# EAGLE design DAMPOWER (EAGLE 7.4.0)

## Sheet 1 of 3
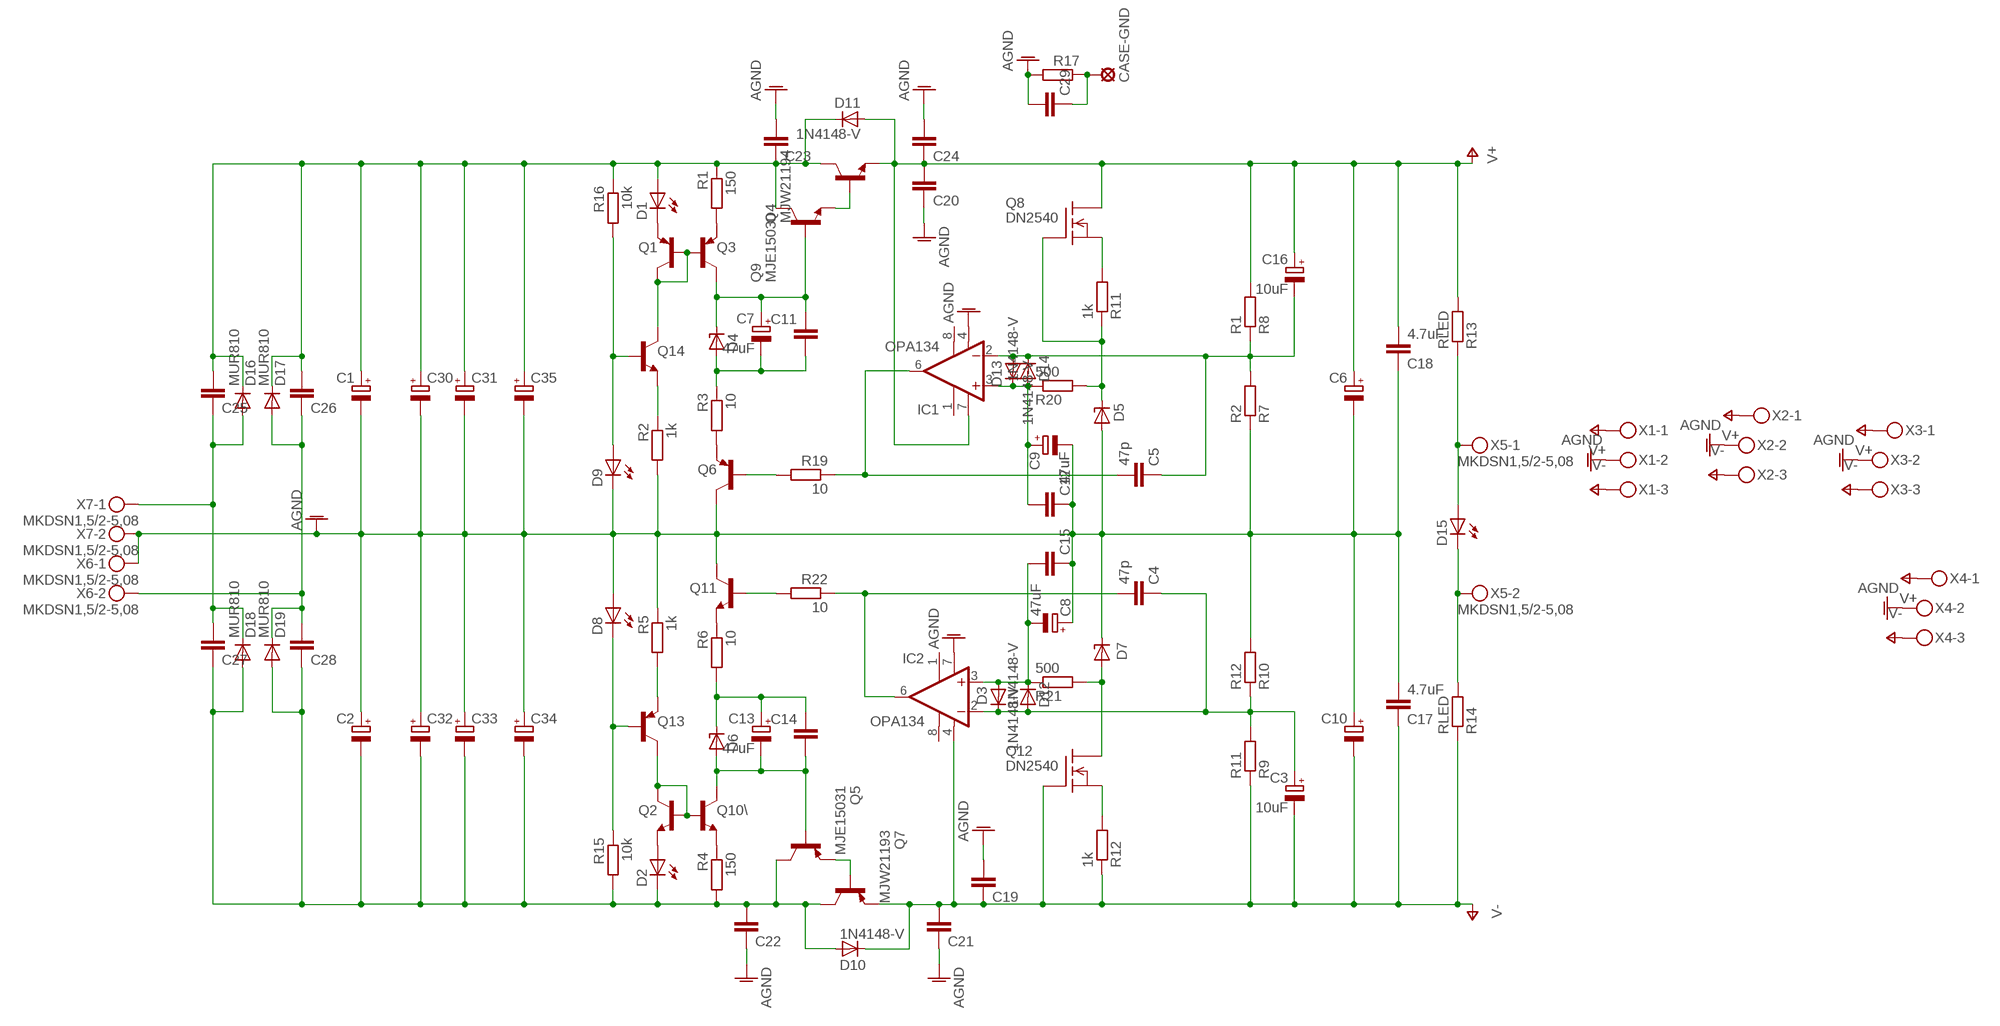
[diagram p0: schematic, sheet 1]

### Parts
C1  CPOL-EUE10-35  [EB35D]
C2  CPOL-EUE10-35  [EB35D]
C3  10uF  CPOL-EUE5-8.5  [E5-8,5]
C4  47p  C-EU025_050-025X075  [C025_050-025X075]
C5  47p  C-EU025_050-025X075  [C025_050-025X075]
C6  CPOL-EUE7.5-18  [E7,5-18]
C7  47uF  CPOL-EUE5-8.5  [E5-8,5]
C8  47uF  CPOL-EUE5-8.5  [E5-8,5]
C9  47uF  CPOL-EUE5-8.5  [E5-8,5]
C10  CPOL-EUE7.5-18  [E7,5-18]
C11  C-EU050-035X075  [C050-035X075]
C12  C-EU050-035X075  [C050-035X075]
C13  47uF  CPOL-EUE5-8.5  [E5-8,5]
C14  C-EU050-035X075  [C050-035X075]
C15  C-EU050-035X075  [C050-035X075]
C16  10uF  CPOL-EUE5-8.5  [E5-8,5]
C17  4.7uF  C-EU050-075X075  [C050-075X075]
C18  4.7uF  C-EU050-075X075  [C050-075X075]
C19  C-EU050-035X075  [C050-035X075]
C20  C-EU050-035X075  [C050-035X075]
C21  C-EU050-035X075  [C050-035X075]
C22  C-EU050-075X075  [C050-075X075]
C23  C-EU050-075X075  [C050-075X075]
C24  C-EU050-035X075  [C050-035X075]
C25  C-EU050-035X075  [C050-035X075]
C26  C-EU050-035X075  [C050-035X075]
C27  C-EU050-035X075  [C050-035X075]
C28  C-EU050-035X075  [C050-035X075]
C29  C-EU102_152-062X184  [C102_152-062X184]
C30  CPOL-EUE7.5-18  [E7,5-18]
C31  CPOL-EUE7.5-18  [E7,5-18]
C32  CPOL-EUE7.5-18  [E7,5-18]
C33  CPOL-EUE7.5-18  [E7,5-18]
C34  CPOL-EUE7.5-18  [E7,5-18]
C35  CPOL-EUE7.5-18  [E7,5-18]
CASE-GND  SE14  [SE14]
D1  LED5MM  [LED5MM]
D2  LED5MM  [LED5MM]
D3  1N4148-V  [1N4148]
D4  1N4728  [DO41Z10]
D5  LT1021  LT1021-V  [DIL08]
D6  1N4728  [DO41Z10]
D7  LT1021  LT1021-V  [DIL08]
D8  LED5MM  [LED5MM]
D9  LED5MM  [LED5MM]
D10  1N4148-V  [1N4148]
D11  1N4148-V  [1N4148]
D12  1N4148-V  [1N4148]
D13  1N4148-V  [1N4148]
D14  1N4148-V  [1N4148]
D15  LED5MM  [LED5MM]
D16  MUR810  [TO220ACS]
D17  MUR810  [TO220ACS]
D18  MUR810  [TO220ACS]
D19  MUR810  [TO220ACS]
IC1  OPA134  OPA134P  [DIL08]
IC2  OPA134  OPA134P  [DIL08]
Q1  MPSA92-PNP-TO92-EBC  [TO92-EBC]
Q2  MPSA42-NPN-TO92-EBC  [TO92-EBC]
Q3  MPSA92-PNP-TO92-EBC  [TO92-EBC]
Q4  MJW21194  MJL4281  [TO-264]
Q5  MJE15031  [TO220KG]
Q6  MPSA92-PNP-TO92-EBC  [TO92-EBC]
Q7  MJW21193  MJL4302  [TO-264]
Q8  DN2540  2N7000  [TO92-]
Q9  MJE15030  [TO220KG]
Q10\  MPSA42-NPN-TO92-EBC  [TO92-EBC]
Q11  MPSA42-NPN-TO92-EBC  [TO92-EBC]
Q12  DN2540  2N7000  [TO92-]
Q13  MPSA92-PNP-TO92-EBC  [TO92-EBC]
Q14  MPSA42-NPN-TO92-EBC  [TO92-EBC]
R1  150  R-EU_0309/12  [0309/12]
R2  1k  R-EU_0309/12  [0309/12]
R3  10  R-EU_0309/12  [0309/12]
R4  150  R-EU_0309/12  [0309/12]
R5  1k  R-EU_0309/12  [0309/12]
R6  10  R-EU_0309/12  [0309/12]
R7  R2  R-EU_0309/12  [0309/12]
R8  R1  R-EU_0309/12  [0309/12]
R9  R11  R-EU_0309/12  [0309/12]
R10  R12  R-EU_0309/12  [0309/12]
R11  1k  R-EU_0309/12  [0309/12]
R12  1k  R-EU_0309/12  [0309/12]
R13  RLED  R-EU_0309/12  [0309/12]
R14  RLED  R-EU_0309/12  [0309/12]
R15  10k  R-EU_0309/12  [0309/12]
R16  10k  R-EU_0309/12  [0309/12]
R17  R-EU_0617/22  [0617/22]
R19  10  R-EU_0309/12  [0309/12]
R20  500  R-EU_0309/12  [0309/12]
R21  500  R-EU_0309/12  [0309/12]
R22  10  R-EU_0309/12  [0309/12]
X1  MKDSN1,5/3-5,08  [MKDSN1,5/3-5,08]
X2  MKDSN1,5/3-5,08  [MKDSN1,5/3-5,08]
X3  MKDSN1,5/3-5,08  [MKDSN1,5/3-5,08]
X4  MKDSN1,5/3-5,08  [MKDSN1,5/3-5,08]
X5  MKDSN1,5/2-5,08  [MKDSN1,5/2-5,08]
X6  MKDSN1,5/2-5,08  [MKDSN1,5/2-5,08]
X7  MKDSN1,5/2-5,08  [MKDSN1,5/2-5,08]

### Nets
AGND: C1.- C2.+ C6.- C8.+ C9.- C10.+ C12.1 C15.1 C17.2 C18.1 C19.2 C20.1 C21.1 C22.1 C23.2 C24.2 C29.2 C29.3 C30.- C31.- C32.+ C33.+ C34.+ C35.- D5.4(GND) D7.6(OUT) D8.A D9.K(C) IC1.4(V-) IC2.7(V+) Q6.C Q11.C R2.2 R5.1 R7.1 R10.2 R17.2 X1.2 X2.2 X3.2 X4.2 X6.1 X7.2
N$1: Q1.B Q1.C Q3.B Q14.C
N$2: D1.K(C) Q1.E
N$3: Q3.E R1.2
N$4: C1.+ C23.1 C25.2 C26.2 C30.+ C31.+ C35.+ D1.A D11.C D16.C D17.C Q4.C Q9.2(C) R1.1 R16.1
N$5: C7.+ C11.1 D4.C Q3.C Q9.1(B)
N$6: C7.- C11.2 D4.A R3.1
N$7: Q6.E R3.2
N$8: Q14.E R2.1
N$9: D9.A Q14.B R16.2
N$10: C8.- C15.2 D3.A D12.C IC2.3(+IN) R21.1
N$11: Q13.E R5.2
N$12: D8.K(C) Q13.B R15.1
N$13: Q11.E R6.1
N$14: C13.+ C14.1 D6.C R6.2
N$15: C13.- C14.2 D6.A Q5.1(B) Q10\.C
N$16: Q2.B Q2.C Q10\.B Q13.C
N$17: Q5.3(E) Q7.B
N$18: Q10\.E R4.1
N$19: D2.A Q2.E
N$21: Q4.B Q9.3(E)
N$22: C2.- C22.2 C27.1 C28.1 C32.- C33.- C34.- D2.K(C) D10.A D18.A D19.A Q5.2(C) Q7.C R4.2 R15.2
N$23: C25.1 C27.2 D16.A D18.C X7.1
N$24: C5.2 C5.3 IC1.6(OUT) R19.1
N$25: C4.2 C4.3 IC2.6(OUT) R22.1
N$26: Q11.B R22.2
N$27: Q6.B R19.2
N$28: C5.1 C16.- D13.A D14.C IC1.2(-IN) R7.2 R8.1
N$29: Q12.3(S) R12.2
N$30: D5.6(OUT) Q8.2(G) R11.1 R20.2
N$31: C9.+ C12.2 D13.C D14.A IC1.3(+IN) R20.1
N$32: D15.K(C) R14.2 X5.2
N$33: D7.4(GND) Q12.1(D) R21.2
N$34: C3.+ C4.1 D3.C D12.A IC2.2(-IN) R9.2 R10.1
N$35: Q8.3(S) R11.2
N$36: D15.A R13.1 X5.1
N$38: C26.1 C28.2 D17.A D19.C X6.2
N$41: C29.1 CASE-GND.MP R17.1
V+: C6.+ C16.+ C18.2 C20.2 C24.1 D11.A IC1.7(V+) Q4.E Q8.1(D) R8.2 R13.2 X1.1 X2.1 X3.1 X4.1
V-: C3.- C10.- C17.1 C19.1 C21.2 D10.C IC2.4(V-) Q7.E Q12.2(G) R9.1 R12.1 R14.1 X1.3 X2.3 X3.3 X4.3
Unconnected: IC1.1(TRIM1) IC1.8(TRIM2) IC2.1(TRIM1) IC2.8(TRIM2)

## Sheet 2 of 3
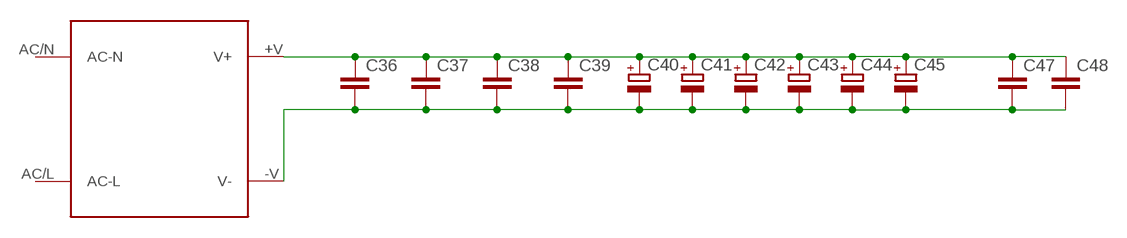
[diagram p1: schematic, sheet 2]

### Parts
C36  C-EU050-030X075  [C050-030X075]
C37  C-EU050-030X075  [C050-030X075]
C38  C-EU050-030X075  [C050-030X075]
C39  C-EU050-030X075  [C050-030X075]
C40  CPOL-EUE3.5-8  [E3,5-8]
C41  CPOL-EUE3.5-8  [E3,5-8]
C42  CPOL-EUE3.5-8  [E3,5-8]
C43  CPOL-EUE3.5-8  [E3,5-8]
C44  CPOL-EUE3.5-8  [E3,5-8]
C45  CPOL-EUE3.5-8  [E3,5-8]
C47  C-EU050-030X075  [C050-030X075]
C48  C-EU050-030X075  [C050-030X075]
U$1  IRM-15-5  [IRM-15]

### Nets
N$42: C36.1 C37.1 C38.1 C39.1 C40.+ C41.+ C42.+ C43.+ C44.+ C45.+ C47.1 C48.1 U$1.+V(V+)
N$43: C36.2 C37.2 C38.2 C39.2 C40.- C41.- C42.- C43.- C44.- C45.- C47.2 C48.2 U$1.-V(V-)
Unconnected: U$1.AC/L(AC-L) U$1.AC/N(AC-N)

## Sheet 3 of 3
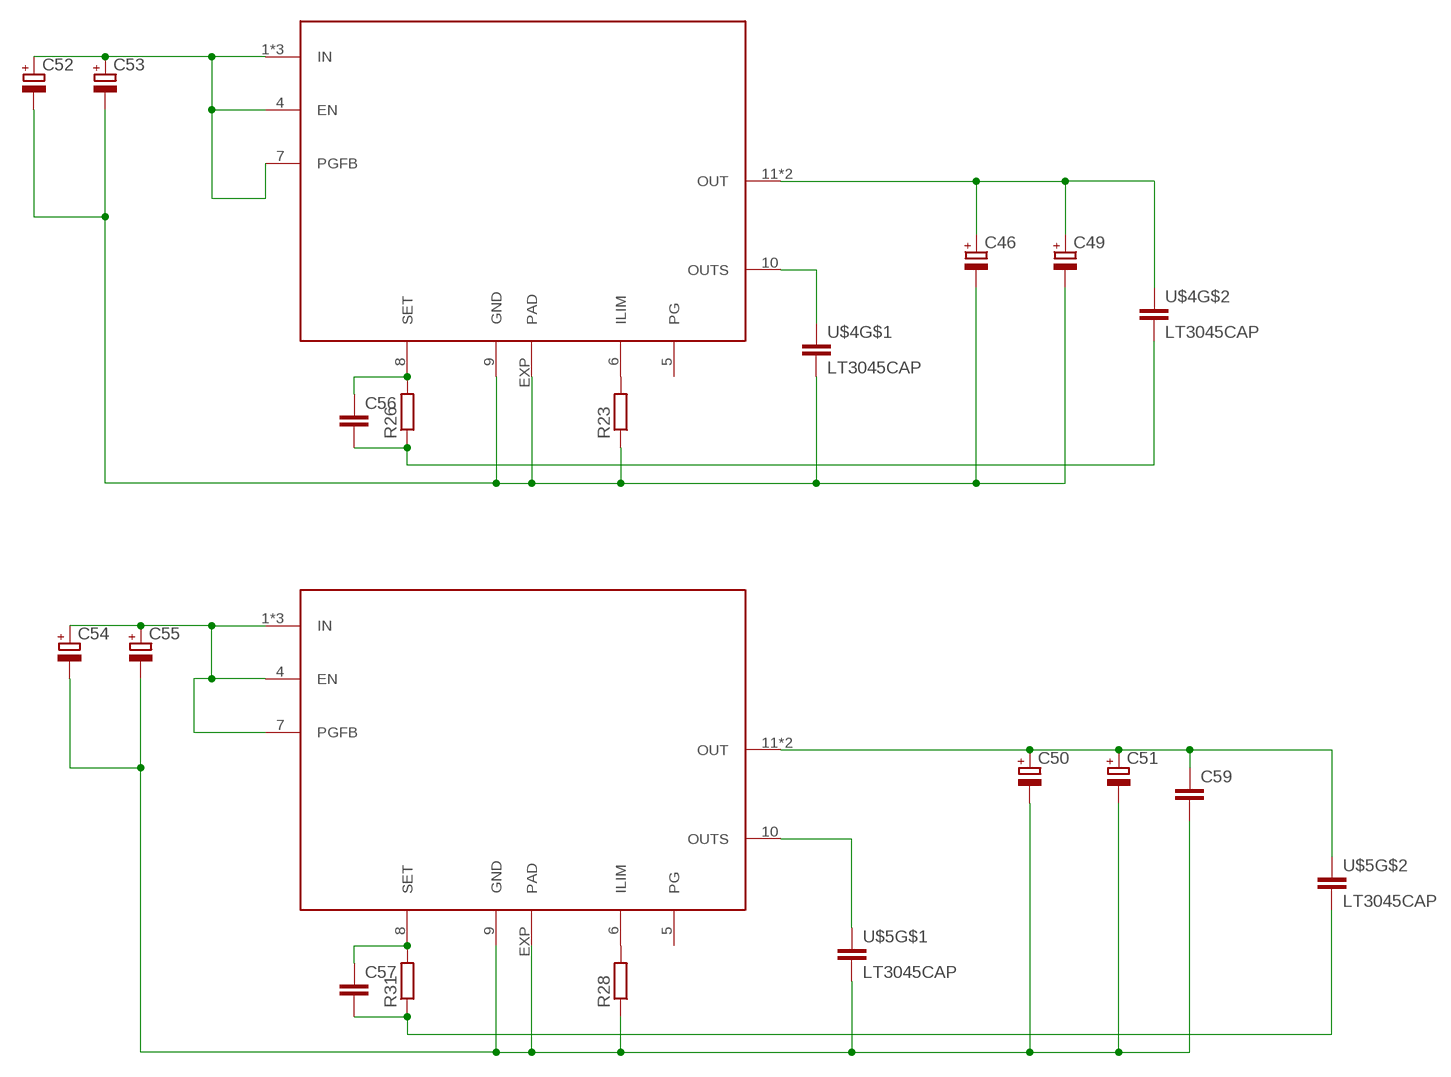
[diagram p2: schematic, sheet 3]

### Parts
C46  CPOL-EUE3.5-8  [E3,5-8]
C49  CPOL-EUE3.5-8  [E3,5-8]
C50  CPOL-EUE3.5-8  [E3,5-8]
C51  CPOL-EUE3.5-8  [E3,5-8]
C52  CPOL-EUE5-10.5  [E5-10,5]
C53  CPOL-EUE5-10.5  [E5-10,5]
C54  CPOL-EUE5-10.5  [E5-10,5]
C55  CPOL-EUE5-10.5  [E5-10,5]
C56  C-EUC1210  [C1210]
C57  C-EUC1210  [C1210]
C59  C-EUC1210  [C1210]
R23  R-EU_MELF0204R  [MINI_MELF-0204R]
R26  R-EU_MELF0204R  [MINI_MELF-0204R]
R28  R-EU_MELF0204R  [MINI_MELF-0204R]
R31  R-EU_MELF0204R  [MINI_MELF-0204R]
U$2  LT3045  [MSOP12]
U$3  LT3045  [MSOP12]
U$4  LT3045CAP  [LT3045CAP]
U$5  LT3045CAP  [LT3045CAP]

### Nets
N$44: C52.+ C53.+ U$2.1(IN) U$2.2(IN) U$2.3(IN) U$2.4(EN) U$2.7(PGFB)
N$45: R23.2 U$2.6(ILIM)
N$46: C56.1 R26.2 U$2.8(SET)
N$47: R28.2 U$3.6(ILIM)
N$48: C57.1 R31.2 U$3.8(SET)
N$49: U$2.10(OUTS) U$4.3
N$50: C46.- C49.- C52.- C53.- R23.1 U$2.9(GND) U$2.EXP(PAD) U$4.5
N$51: C46.+ C49.+ U$2.11(OUT) U$2.12(OUT) U$4.4
N$52: U$3.10(OUTS) U$5.3
N$53: C50.- C51.- C54.- C55.- C59.2 R28.1 U$3.9(GND) U$3.EXP(PAD) U$5.5
N$54: C56.2 R26.1 U$4.6
N$55: C54.+ C55.+ U$3.1(IN) U$3.2(IN) U$3.3(IN) U$3.4(EN) U$3.7(PGFB)
N$56: C57.2 R31.1 U$5.6
N$57: C50.+ C51.+ C59.1 U$3.11(OUT) U$3.12(OUT) U$5.4
Unconnected: U$2.5(PG) U$3.5(PG)

## Library data of the parts
C1-C3 C6-C10 C13 C16 C30-C35 C40-C46 C49-C55 = Vwvwbg:CPOL-EU: POLARIZED CAPACITOR, European symbol
C4 C5 C11 C12 C14 C15 C17-C29 C36-C39 C47 C48 C56 C57 C59 = Vwvwbg:C-EU: CAPACITOR, European symbol
CASE-GND = solpad:SE14: SOLDER PAD E1553, drill 1,4mm, distributor Buerklin, 07F820
D1 D2 D8 D9 D15 = led:LED: LED OSRAM: - CHIPLED LG R971, LG N971, LY N971, LG Q971, LY Q971, LO R971, LY R971 LH N974, LH R974 LS Q976, LO Q976, LY Q976 LO Q996 - Hyper CHIPLED LW Q18S LB Q993, LB Q99A, LB R99A - SideLED LS A670, LO A670, LY A670, LG A670, LP A670 LB A673, LV A673, LT A673, LW A673 LH A674 LY A675 LS A676, LA A676, LO A676, LY A676, LW A676 LS A679, LY A679, LG A679 - Hyper Micro SIDELED® LS Y876, LA Y876, LO Y876, LY Y876 LT Y87S - SmartLED LW L88C, LW L88S LB L89C, LB L89S, LG L890 LS L89K, LO L89K, LY L89K LS L896, LA L896, LO L896, LY L896 - TOPLED LS T670, LO T670, LY T670, LG T670, LP T670 LSG T670, LSP T670, LSY T670, LOP T670, LYG T670 LG T671, LOG T671, LSG T671 LB T673, LV T673, LT T673, LW T673 LH T674 LS T676, LA T676, LO T676, LY T676, LB T676, LH T676, LSB T676, LW T676 LB T67C, LV T67C, LT T67C, LS T67K, LO T67K, LY T67K, LW E67C LS E67B, LA E67B, LO E67B, LY E67B, LB E67C, LV E67C, LT E67C LW T67C LS T679, LY T679, LG T679 LS T770, LO T770, LY T770, LG T770, LP T770 LB T773, LV T773, LT T773, LW T773 LH T774 LS E675, LA E675, LY E675, LS T675 LS T776, LA T776, LO T776, LY T776, LB T776 LHGB T686 LT T68C, LB T68C - Hyper Mini TOPLED® LB M676 - Mini TOPLED Santana® LG M470 LS M47K, LO M47K, LY M47K Source: http://www.osram.convergy.de LUXEON: - LUMILED® LXK2-PW12-R00, LXK2-PW12-S00, LXK2-PW14-U00, LXK2-PW14-V00 LXK2-PM12-R00, LXK2-PM12-S00, LXK2-PM14-U00 LXK2-PE12-Q00, LXK2-PE12-R00, LXK2-PE12-S00, LXK2-PE14-T00, LXK2-PE14-U00 LXK2-PB12-K00, LXK2-PB12-L00, LXK2-PB12-M00, LXK2-PB14-N00, LXK2-PB14-P00, LXK2-PB14-Q00 LXK2-PR12-L00, LXK2-PR12-M00, LXK2-PR14-Q00, LXK2-PR14-R00 LXK2-PD12-Q00, LXK2-PD12-R00, LXK2-PD12-S00 LXK2-PH12-R00, LXK2-PH12-S00 LXK2-PL12-P00, LXK2-PL12-Q00, LXK2-PL12-R00 Source: www.luxeon.com KINGBRIGHT: KA-3528ASYC Source: www.kingbright.com
D3 D10-D14 = diode:1N4148-V
D4 D6 = diode:1N4728: Z DIODE 3.3 V, 1W, 5 percent
D5 D7 = linear-technology:LT1021-V
D16-D19 = diode:MUR810: DIODE
IC1 IC2 = burr-brown:OPA134: Operational Amplifiers SoundPlus(TM) High Performance Audio; MF: TEXAS INSTRUMENTS; MPN: OPA134PA; OC_FARNELL: 1335032; OC_NEWARK: 75C4599
Q1 Q3 Q6 Q13 = transistor:*-PNP-: PNP Transistror
Q2 Q10\ Q11 Q14 = transistor:*-NPN-: NPN Transistror BF959 corrected 2008.03.06
Q4 = TO264:MJL4281: MJL4281 NPN BCE TO-264
Q5 = transistor:MJE15031
Q7 = TO264:MJL4302: MJL4302 PNP BCE TO-264
Q8 Q12 = tranzistory FET:2N7000
Q9 = transistor:MJE15030
R1-R17 R19-R23 R26 R28 R31 = Vwvwbg:R-EU_: RESISTOR, European symbol
U$1 = Vwvwbg:IRM-15-5
U$2 U$3 = Vwvwbg:LT3045
U$4 U$5 = Vwvwbg:LT3045CAP
X1-X4 = con-phoenix-508:MKDSN1,5/3-5,08: MKDSN 1,5/ 3-5,08 Printklemme Nennstrom: 13,5 A Nennspannung: 250 V Rastermaß: 5,08 mm Polzahl: 3 Anschlussart: Schraubanschluss Montage: Löten Anschlussrichtung Leiter/Platine: 0 ° Artikelnummer: 1729131 Source: http://eshop.phoenixcontact.com .. 1729131.pdf
X5-X7 = con-phoenix-508:MKDSN1,5/2-5,08: MKDSN 1,5/ 2-5,08 Printklemme Nennstrom: 13,5 A Nennspannung: 250 V Rastermaß: 5,08 mm Polzahl: 2 Anschlussart: Schraubanschluss Montage: Löten Anschlussrichtung Leiter/Platine: 0 ° Artikelnummer: 1729128 Source: http://eshop.phoenixcontact.com .. 1729128.pdf

## Board
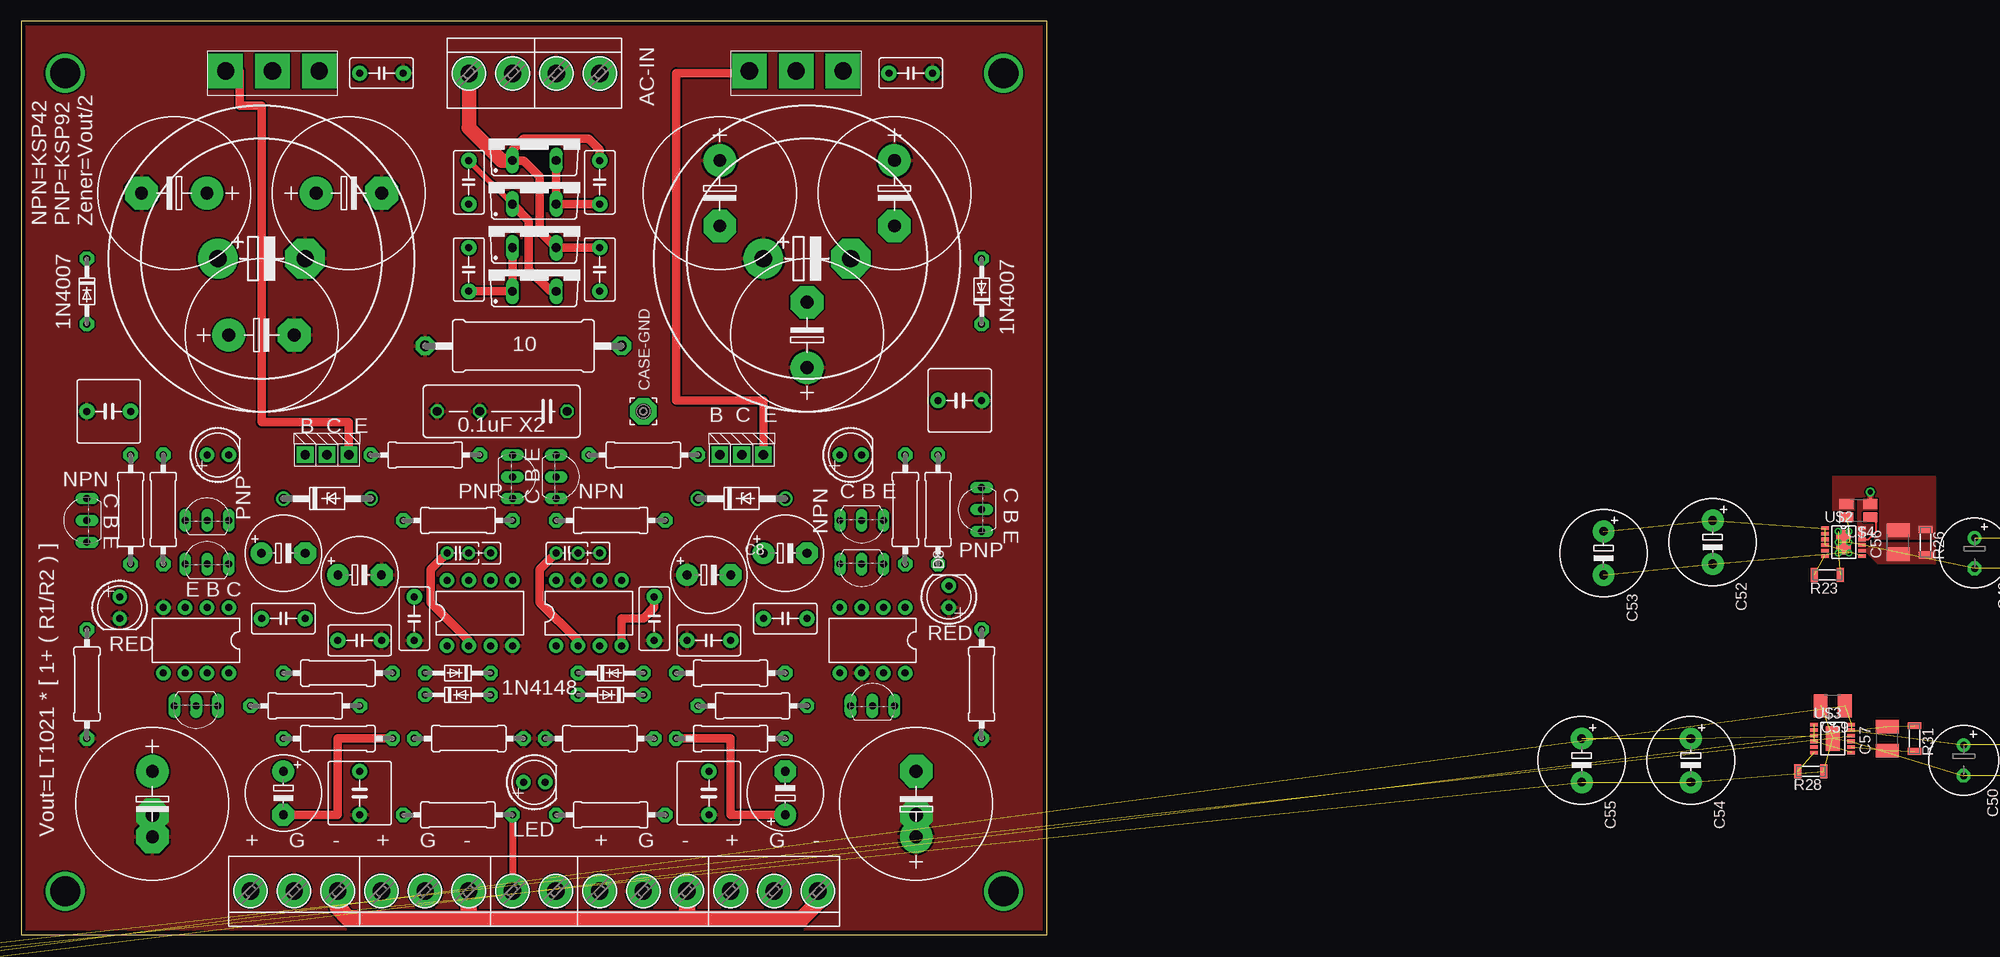
[diagram p3: board, top side]
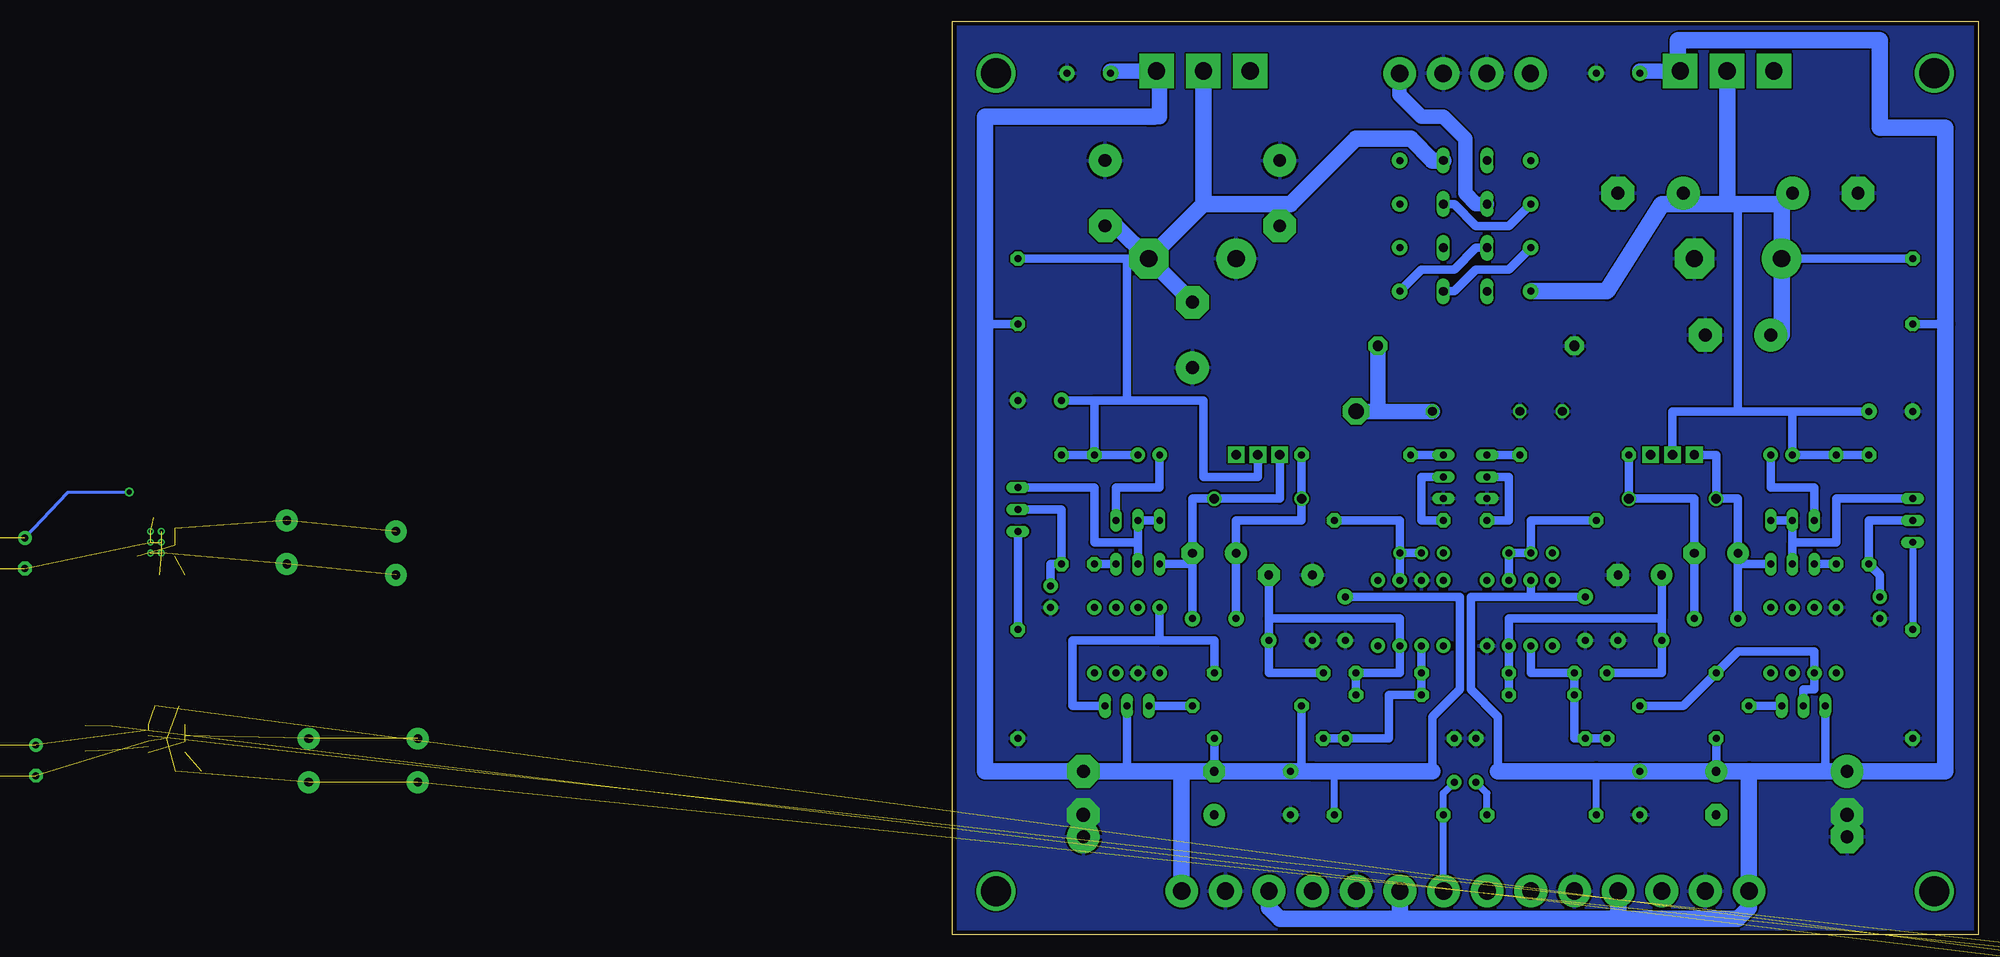
[diagram p4: board, bottom side, seen from below]

Size 119.36 x 106.35 mm. Coordinates in mm from the lower left corner, seen from the top.
Outline: 0,0 119.36,0 119.36,106.35 0,106.35 0,0
Copper layers (1*16): Top 0.035mm / dielectric 1.5mm / Bottom 0.035mm
Design rules "default *": minimum track width 10mil, minimum drill 24mil, track to track 8mil, track to pad 12mil, pad to pad 8mil, via to via 8mil, smd to smd 8mil, copper to edge 20mil, drill to drill 8mil, minimum pad ring 10mil, minimum via ring 8mil, stop-mask expansion 4mil, vias tented up to drill 0mil, thermal gap 10mil

### Footprints (pad centres in the part's own frame; a part is rotated, then mirrored left to right if it is on the bottom)
EB35D = drill 2.007 pad 4.597: + -5.08,0 | drill 2.007 pad 4.597 octagon: - 5.08,0
E5-8,5 = drill 1.016 pad 2.54: + -2.54,0 | drill 1.016 pad 2.54 octagon: - 2.54,0
C025_050-025X075 = drill 0.813 pad 1.524: 1 -1.27,0; 2 1.27,0; 3 3.81,0
E7,5-18 = drill 1.5 pad 3.81: + -3.81,0 | drill 1.5 pad 3.81 octagon: - 3.81,0
C050-035X075 = drill 0.813 pad 1.778: 1 -2.54,0; 2 2.54,0
C050-075X075 = drill 0.813 pad 1.778: 1 -2.54,0; 2 2.54,0
C102_152-062X184 = drill 1.016 octagon: 1 -5.08,0; 2 5.08,0; 3 10.033,0
C050-030X075 = drill 0.813 octagon: 1 -2.54,0; 2 2.54,0
E3,5-8 = drill 0.813 pad 1.6: + -1.778,0 | drill 0.813 pad 1.6 octagon: - 1.778,0
E5-10,5 = drill 1.016 pad 2.54: + -2.54,0; - 2.54,0
C1210 = smd 1.6 x 2.7: 1 -1.4,0; 2 1.4,0
SE14 = drill 1.778 pad 3.048 octagon: MP 0,0
LED5MM = drill 0.813 pad 1.676: A -1.27,0; K 1.27,0
1N4148 = drill 0.813 pad 1.676 octagon: A 3.81,0; C -3.81,0
DO41Z10 = drill 1.118: A 5.08,0; C -5.08,0
DIL08 = drill 0.813 pad 1.676: 1 -3.81,-3.81; 2 -1.27,-3.81; 3 1.27,-3.81; 4 3.81,-3.81; 5 3.81,3.81; 6 1.27,3.81; 7 -1.27,3.81; 8 -3.81,3.81
TO220ACS = drill 1.016 long: A 2.54,-2.54; C -2.54,-2.54
TO92-EBC = drill 0.813 long: B 0,-1.27; C 2.54,-1.27; E -2.54,-1.27
TO-264 = drill 2 pad 4 square: B -5.45,-6.096; C 0,-6.096; E 5.45,-6.096
TO220KG = drill 1.1 pad 1.93 square: 1 -2.54,0; 2 0,0; 3 2.54,0
TO92- = drill 0.813 pad 1.422 long: 1 2.54,0; 2 0,0; 3 -2.54,0
0309/12 = drill 0.813 pad 1.676 octagon: 1 -6.35,0; 2 6.35,0
0617/22 = drill 1.2 pad 2.184 octagon: 1 -11.43,0; 2 11.43,0
MINI_MELF-0204R = smd 0.8 x 1.6: 1 -1.5,0; 2 1.5,0
IRM-15 = drill 1.1 pad 2.184 octagon: +V 48.4,16; -V 48.4,24; AC/L 3.4,3.2; AC/N 3.4,24
MSOP12 = smd 0.9 x 0.42: 1 -2.163,1.625; 2 -2.163,0.975; 3 -2.163,0.325; 4 -2.163,-0.325; 5 -2.163,-0.975; 6 -2.163,-1.625; 7 2.15,-1.625; 8 2.15,-0.975; 9 2.15,-0.325; 10 2.15,0.325; 11 2.15,0.975; 12 2.15,1.625 | smd 1.65 x 2.85: EXP 0,0
LT3045CAP = smd 1.6 x 1.143: 3 -1.394,0.767; 4 -1.4,-0.776; 5 1.402,0.776; 6 1.403,-0.767
MKDSN1,5/3-5,08 = drill 2 pad 3.81: 1 -7.641,0.025; 2 -2.561,0.025; 3 2.519,0.025
MKDSN1,5/2-5,08 = drill 2 pad 3.81: 1 -2.561,0.025; 2 2.519,0.025

### Placement (x,y rotation side)
C1  27.94,78.74 0 top
C2  91.44,78.74 0 top
C3  88.9,16.51 90 top
C4  63.5,44.45 0 top
C5  50.8,44.45 0 top
C6  15.24,15.24 270 top
C7  30.48,44.45 0 top
C8  80.01,41.91 0 top
C9  39.37,41.91 0 top
C10  104.14,15.24 90 top
C11  30.48,36.83 0 top
C12  39.37,34.29 180 top
C13  88.9,44.45 0 top
C14  88.9,36.83 0 top
C15  80.01,34.29 0 top
C16  30.48,16.51 270 top
C17  80.01,16.51 270 top
C18  39.37,16.51 90 top
C19  73.66,36.83 270 top
C20  45.72,36.83 90 top
C21  103.5,100.33 180 top
C22  109.22,62.23 180 top
C23  10.16,60.96 180 top
C24  41.91,100.33 0 top
C25  52.07,77.47 270 top
C26  67.31,77.47 270 top
C27  52.07,87.63 90 top
C28  67.31,87.63 90 top
C29  58.42,60.96 180 top
C30  17.78,86.36 180 top
C31  38.1,86.36 0 top
C32  81.28,86.36 270 top
C33  101.6,86.36 270 top
C34  91.44,69.85 90 top
C35  27.94,69.85 0 top
C36  -10.16,52.07 0 top  (outside the outline)
C37  -10.16,48.26 0 top  (outside the outline)
C38  -10.16,44.45 0 top  (outside the outline)
C39  -10.16,40.64 0 top  (outside the outline)
C40  -19.05,49.53 180 top  (outside the outline)
C41  -19.05,40.64 180 top  (outside the outline)
C42  -19.05,31.75 180 top  (outside the outline)
C43  -27.94,49.53 180 top  (outside the outline)
C44  -27.94,40.64 180 top  (outside the outline)
C45  -27.94,31.75 180 top  (outside the outline)
C46  236.22,44.45 270 top  (outside the outline)
C47  -10.16,36.83 0 top  (outside the outline)
C48  -10.16,31.75 0 top  (outside the outline)
C49  227.33,44.45 270 top  (outside the outline)
C50  226.06,20.32 270 top  (outside the outline)
C51  243.84,20.32 270 top  (outside the outline)
C52  196.85,45.72 270 top  (outside the outline)
C53  184.15,44.45 270 top  (outside the outline)
C54  194.31,20.32 270 top  (outside the outline)
C55  181.61,20.32 270 top  (outside the outline)
C56  218.44,45.72 90 top  (outside the outline)
C57  217.17,22.86 90 top  (outside the outline)
C59  210.82,26.67 180 top  (outside the outline)
CASE-GND  72.39,60.96 0 top
D1  22.86,55.88 0 top
D2  96.52,55.88 0 top
D3  68.58,30.48 0 top
D4  35.56,50.8 0 top
D5  20.32,34.29 180 top
D6  83.82,50.8 0 top
D7  99.06,34.29 180 top
D8  107.95,39.37 90 top
D9  11.43,38.1 270 top
D10  111.76,74.93 90 top
D11  7.62,74.93 270 top
D12  68.58,27.94 180 top
D13  50.8,30.48 180 top
D14  50.8,27.94 0 top
D15  59.69,17.78 0 top
D16  59.69,77.47 0 top
D17  59.69,82.55 0 top
D18  59.69,87.63 0 top
D19  59.69,92.71 0 top
IC1  53.34,37.47 0 top
IC2  66.04,37.47 0 top
Q1  21.59,49.53 0 top
Q2  97.79,46.99 180 top
Q3  21.59,44.45 0 top
Q4  29.21,106.68 0 top
Q5  83.82,55.88 0 top
Q6  58.42,53.34 270 top
Q7  90.17,106.68 0 top
Q8  20.32,26.67 180 top
Q9  35.56,55.88 0 top
Q10\  97.79,41.91 180 top
Q11  63.5,53.34 270 top
Q12  99.06,26.67 0 top
Q13  110.49,49.53 90 top
Q14  6.35,48.26 90 top
R1  16.51,49.53 270 top
R2  7.62,29.21 270 top
R3  46.99,55.88 0 top
R4  102.87,49.53 90 top
R5  111.76,29.21 90 top
R6  72.39,55.88 0 top
R7  52.07,22.86 180 top
R8  36.83,22.86 180 top
R9  82.55,22.86 180 top
R10  67.31,22.86 180 top
R11  33.02,26.67 180 top
R12  85.09,26.67 0 top
R13  50.8,13.97 180 top
R14  68.58,13.97 180 top
R15  106.68,49.53 90 top
R16  12.7,49.53 270 top
R17  58.42,68.58 180 top
R19  50.8,48.26 0 top
R20  36.83,30.48 180 top
R21  82.55,30.48 0 top
R22  68.58,48.26 180 top
R23  210.19,41.91 180 top  (outside the outline)
R26  221.62,45.72 270 top  (outside the outline)
R28  208.28,19.05 180 top  (outside the outline)
R31  220.34,22.86 270 top  (outside the outline)
U$1  -31.75,106.68 270 top  (outside the outline)
U$2  212.09,45.72 0 top  (outside the outline)
U$3  210.82,22.86 0 top  (outside the outline)
U$4  213.8,49.4 180 top  (outside the outline)
U$5  -31.75,-5.08 0 top  (outside the outline)
X1  90.17,5.08 0 top
X2  74.93,5.08 0 top
X3  49.53,5.08 0 top
X4  34.29,5.08 0 top
X5  59.69,5.08 0 top
X6  54.61,100.33 180 top
X7  64.77,100.33 180 top

### Tracks (layer width: path | path; a pad name or v marks a point on that pad's centre or on a via)
AGND  (via drill 1.6 pad 3.81)
  other vias: 15.24,13.97 104.14,13.97
  pour Top: 0,106.68 120.65,106.68 120.65,-1.27 0,0
  pour Bottom: 0,106.68 119.38,106.68 119.38,0 0,0
N$1
  Bottom 1.016: Q3.B 21.59,45.72 | 21.59,45.72 16.51,45.72 16.51,50.8 Q14.C | 21.59,45.72 Q1.B Q1.C
N$2
  Bottom 1.016: Q1.E 19.05,52.07 24.13,52.07 D1.K
N$3
  Bottom 1.016: R1.2 Q3.E
N$4
  Top 1.016: D17.C D16.C C25.2
  Bottom 1.016: R16.1 R1.1 D1.A 21.59,60.96 | Q9.2 35.56,60.96 27.94,60.96 | D11.C C1.+ | D17.C 58.42,80.01 60.96,77.47 64.77,77.47 C26.2 | 21.59,60.96 27.94,60.96 | C23.1 21.59,60.96 | 27.94,60.96 27.94,85.09
  Bottom 1.93: 22.86,85.09 C1.+ 22.86,69.85 C35.+ | 22.86,85.09 27.94,85.09 29.21,85.09 | 29.21,85.09 34.29,85.09 | 34.29,85.09 36.83,85.09 43.18,74.93 C25.2 | Q4.C 29.21,85.09 | C30.+ 22.86,85.09 | C31.+ 34.29,85.09
N$5
  Bottom 1.016: Q9.1 30.48,55.88 D4.C 27.94,50.8 C7.+ | C7.+ 27.94,43.18 Q3.C | C11.1 C7.+
N$6
  Bottom 1.016: R3.1 D4.A 33.02,50.8 C7.- C11.2
N$7
  Bottom 1.016: Q6.E R3.2
N$8
  Bottom 0.813: Q14.E R2.1
N$9
  Bottom 1.016: D9.A 11.43,41.91 R16.2 12.7,48.26 Q14.B
N$10
  Bottom 1.016: C8.- 82.55,36.83 | 82.55,36.83 C15.2 82.55,30.48 R21.1 | 82.55,36.83 67.31,36.83 IC2.3 67.31,30.48 D3.A D12.C
N$11
  Bottom 1.016: Q13.E R5.2
N$12
  Bottom 1.016: Q13.B 106.68,49.53 R15.1 107.95,43.18 D8.K
N$13
  Bottom 1.016: Q11.E R6.1
N$14
  Bottom 1.016: R6.2 D6.C 78.74,48.26 86.36,48.26 C13.+ C14.1
N$15
  Bottom 1.016: Q5.1 81.28,50.8 D6.A 91.44,50.8 C13.- 91.44,43.18 | 91.44,43.18 Q10\.C | 91.44,43.18 C14.2
N$16
  Bottom 1.016: 97.79,45.72 Q2.B Q2.C | 97.79,45.72 Q10\.B | Q13.C 102.87,52.07 102.87,45.72 97.79,45.72
N$17
  Top 1.016: Q5.3 86.36,62.23 76.2,62.23 76.2,100.33 84.72,100.33 Q7.B
N$18
  Bottom 1.016: R4.1 Q10\.E
N$19
  Bottom 1.016: Q2.E 100.33,52.07 95.25,52.07 D2.A
N$20  (via drill 3.5)
  other vias: 5.08,100.33
N$21
  Top 1.016: Q4.B 25.4,100.58 25.4,96.52 27.94,96.52 27.94,59.69 38.1,59.69 Q9.3
N$22
  Top 1.016: D19.A D18.A C28.1
  Bottom 1.016: C27.1 54.61,82.55 58.42,82.55 60.96,85.09 D18.A | C2.- 99.06,78.74 | 99.06,78.74 D10.A | R15.2 R4.2 | R4.2 D2.K | Q5.2 83.82,53.34 90.17,53.34 90.17,62.23 99.06,62.23 | 99.06,62.23 102.87,62.23 | 102.87,62.23 R4.2 | 99.06,62.23 99.06,78.74 | C22.2 102.87,62.23
  Bottom 1.93: C2.- 90.17,85.09 | 90.17,85.09 Q7.C | D19.A 63.5,90.17 66.04,92.71 72.39,92.71 80.01,85.09 81.28,85.09 | 81.28,85.09 90.17,85.09 | C32.- 81.28,85.09 | C33.- 100.33,82.55 C2.- | C34.- C2.-
N$23
  Top 0.61: C27.2 D18.C
  Top 1.016: D18.C 59.05,83.19 59.05,77.47 61.59,74.93 D16.A
  Bottom 1.016: C25.1 54.61,77.47 58.42,77.47 60.96,74.93 D16.A
  Bottom 1.676: X7.1 67.33,97.81 64.77,95.25 62.23,95.25 59.69,92.71 59.69,86.36 58.42,85.09 D18.C
N$24
  Bottom 1.016: R19.1 52.07,48.26 C5.2 C5.3 IC1.6
N$25
  Bottom 1.016: R22.1 67.31,48.26 C4.3 | C4.2 C4.3 | IC2.6 C4.3
N$26
  Bottom 1.016: Q11.B 64.77,53.34 64.77,48.26 R22.2
N$27
  Bottom 1.016: R19.2 54.61,48.26 54.61,53.34 Q6.B
N$28
  Top 1.016: C16.- 36.83,13.97 36.83,22.86 R8.1 | IC1.2 52.07,34.29 47.62,38.73 47.62,42.55 C5.1
  Bottom 1.016: IC1.2 52.07,30.48 D13.A D14.C 46.99,22.86 R7.2 R8.1
N$29
  Bottom 1.016: Q12.3 R12.2
N$30
  Bottom 1.016: Q8.2 20.32,28.57 19.05,28.57 D5.6 19.05,33.02 27.94,33.02 R20.2 34.29,26.67 R11.1
N$31
  Bottom 1.016: D14.A D13.C IC1.3 54.61,36.83 36.83,36.83 | C9.+ 36.83,36.83 | R20.1 36.83,30.48 C12.2 36.83,36.83
N$32
  Bottom 0.813: D15.K 62.23,16.51 R14.2 62.21,13.95 X5.2
  Bottom 1.016: R14.2 62.21,13.97
N$33
  Bottom 1.016: D7.4 95.25,34.29 | 95.25,34.29 88.9,34.29 R21.2 | 95.25,34.29 105.41,34.29 105.41,26.67 Q12.1
N$34
  Top 1.016: C3.+ 82.55,13.97 82.55,22.86 R9.2 | IC2.2 64.77,34.29 60.33,38.73 60.33,42.55 C4.1
  Bottom 1.016: IC2.2 D3.C D12.A 68.58,27.94 68.58,22.86 R10.1 R9.2
N$35
  Bottom 1.016: Q8.3 R11.2
N$36
  Top 0.813: R13.1 57.15,5.13 X5.1
  Bottom 0.813: R13.1 57.15,16.51 D15.A | 57.15,5.13 X5.1
  Bottom 1.016: R13.1 57.13,13.97
N$37  (via drill 3.5)
  other vias: 5.08,5.08
N$38
  Top 1.016: C26.1 D17.A 60.33,81.92 60.33,88.27 58.42,90.17 D19.C 57.15,91.44 58.42,92.71 66.04,92.71 67.31,91.44 C28.2
  Top 1.676: X6.2 52.09,94 52.07,93.98 55.88,90.17 D19.C
N$39  (via drill 3.5)
  other vias: 114.3,5.08
N$40  (via drill 3.5)
  other vias: 114.3,100.33
N$41
  Bottom 1.27: C29.1 69.85,60.96 71.12,60.96
  Bottom 1.778: R17.1 69.85,60.96 | CASE-GND.MP C29.1
N$42  (12 unrouted)
N$43  (12 unrouted)
N$44  (6 unrouted)
N$45  (1 unrouted)
N$46
  pour Top (no thermals): 214.44,44.83 214.76,44.83 215.58,45.66 222.69,45.66 222.69,43.18 216.15,43.24 214.88,44.45 214.82,44.51 214.44,44.51
N$47  (1 unrouted)
N$48  (2 unrouted)
N$49
  Top 0.254: U$2.10 214.96,46.05 215.9,46.99 215.9,48.26 215.57,48.26 U$4.3
N$50  (via drill 0.4 pad 0.2)  (13 unrouted)
  other vias: 211.46,46.99 212.72,46.99 212.72,45.72 212.72,44.45 211.46,44.45 211.46,45.72
N$51  (via drill 0.6)  (1 unrouted)
  Top 0.406: U$4.4 215.21,51.11 v215.2,51.56
  Bottom 0.406: v215.2,51.56 222.38,51.5 C49.+
  pour Top (rank 2, no thermals): 213.74,50.99 213.74,46.48 216.28,46.48 216.28,51.05 213.74,51.05
N$52  (1 unrouted)
N$53  (8 unrouted)
N$54
  pour Top (no thermals): 215.65,46.16 222.76,46.16 222.76,53.34 210.82,53.34 210.82,49.53 213.36,49.53 213.36,51.05 216.28,51.05 216.28,46.8
N$55  (6 unrouted)
N$56  (2 unrouted)
N$57  (5 unrouted)
V+
  Bottom 0.813: R13.2 44.45,19.05
  Bottom 1.016: C20.2 52.07,39.37 | 52.07,39.37 59.05,39.37 59.05,28.57 55.88,25.4 55.88,19.05 | R8.2 C16.+ | Q8.1 17.78,19.05 | D11.A 3.81,71.12 | IC1.7 52.07,39.37 | Q4.E
  Bottom 1.778: Q4.E 39.37,100.58 C24.1
  Bottom 1.93: 26.67,19.05 C16.+ C18.2 44.45,19.05 55.88,19.05 | 26.67,19.05 17.78,19.05 C6.+ 3.81,19.05 3.81,71.12 3.81,93.98 11.43,93.98 11.43,104.14 34.92,104.14 34.92,100.85 Q4.E | 26.67,19.05 26.67,6.38 X4.1 26.67,5.08 26.67,3.17 27.94,1.91 41.91,1.91 | X3.1 41.89,1.93 41.91,1.91 | X2.1 67.29,1.93 67.31,1.91 | 67.31,1.91 81.28,1.91 82.53,3.15 X1.1 | 67.31,1.91 41.91,1.91
V-
  Top 1.016: IC2.4 69.85,36.83 72.39,36.83 73.66,38.1 C19.1
  Top 1.93: X4.3 36.81,3.2 38.1,1.91 52.07,1.91 | 52.07,1.91 77.47,1.91 | 77.47,1.91 90.81,1.91 92.71,3.81 92.71,5.08 X1.3 | X2.3 77.45,1.93 77.47,1.91 | X3.3 52.05,1.93 52.07,1.91
  Bottom 0.813: R14.1 74.93,19.03
  Bottom 1.016: 77.45,19.03 77.47,19.05 | Q12.2 99.06,19.05 | R12.1 78.74,19.05 | 63.5,19.03 63.5,25.4 60.33,28.57 60.33,39.37 C19.1 | C3.- R9.1 | D10.C 115.57,71.12
  Bottom 1.778: 95.89,95.25 95.62,95.25 | C21.2 100.97,100.58 Q7.E 95.25,100.58 95.25,95.25 96.52,95.25
  Bottom 1.93: 77.47,19.05 78.74,19.05 C17.1 C3.- 92.71,19.05 | 92.71,19.05 99.06,19.05 C10.- 115.57,19.05 115.57,71.12 115.57,95.25 96.52,95.25 95.89,95.25 | 77.45,19.03 74.93,19.03 63.5,19.03 | X1.3 92.71,5.11 92.71,19.05

### Text on the board
tPlace: AC-IN | NPN=KSP42 / PNP=KSP92 / Zener=Vout/2 | 1N4007 | 1N4007 | 10 | 0.1uF X2 | B C E | B C E | NPN | NPN | C B E | C B E | PNP | NPN | C B E | C B E | PNP | PNP | E B C | RED | RED | Vout=LT1021 * [ 1+ ( R1/R2 ) ] | LED | - | - | - | -
tNames: 1N4148 | + | G | + | G | + | G | + | G